# EAGLE schematic ultraino6 (EAGLE 8.3.2)
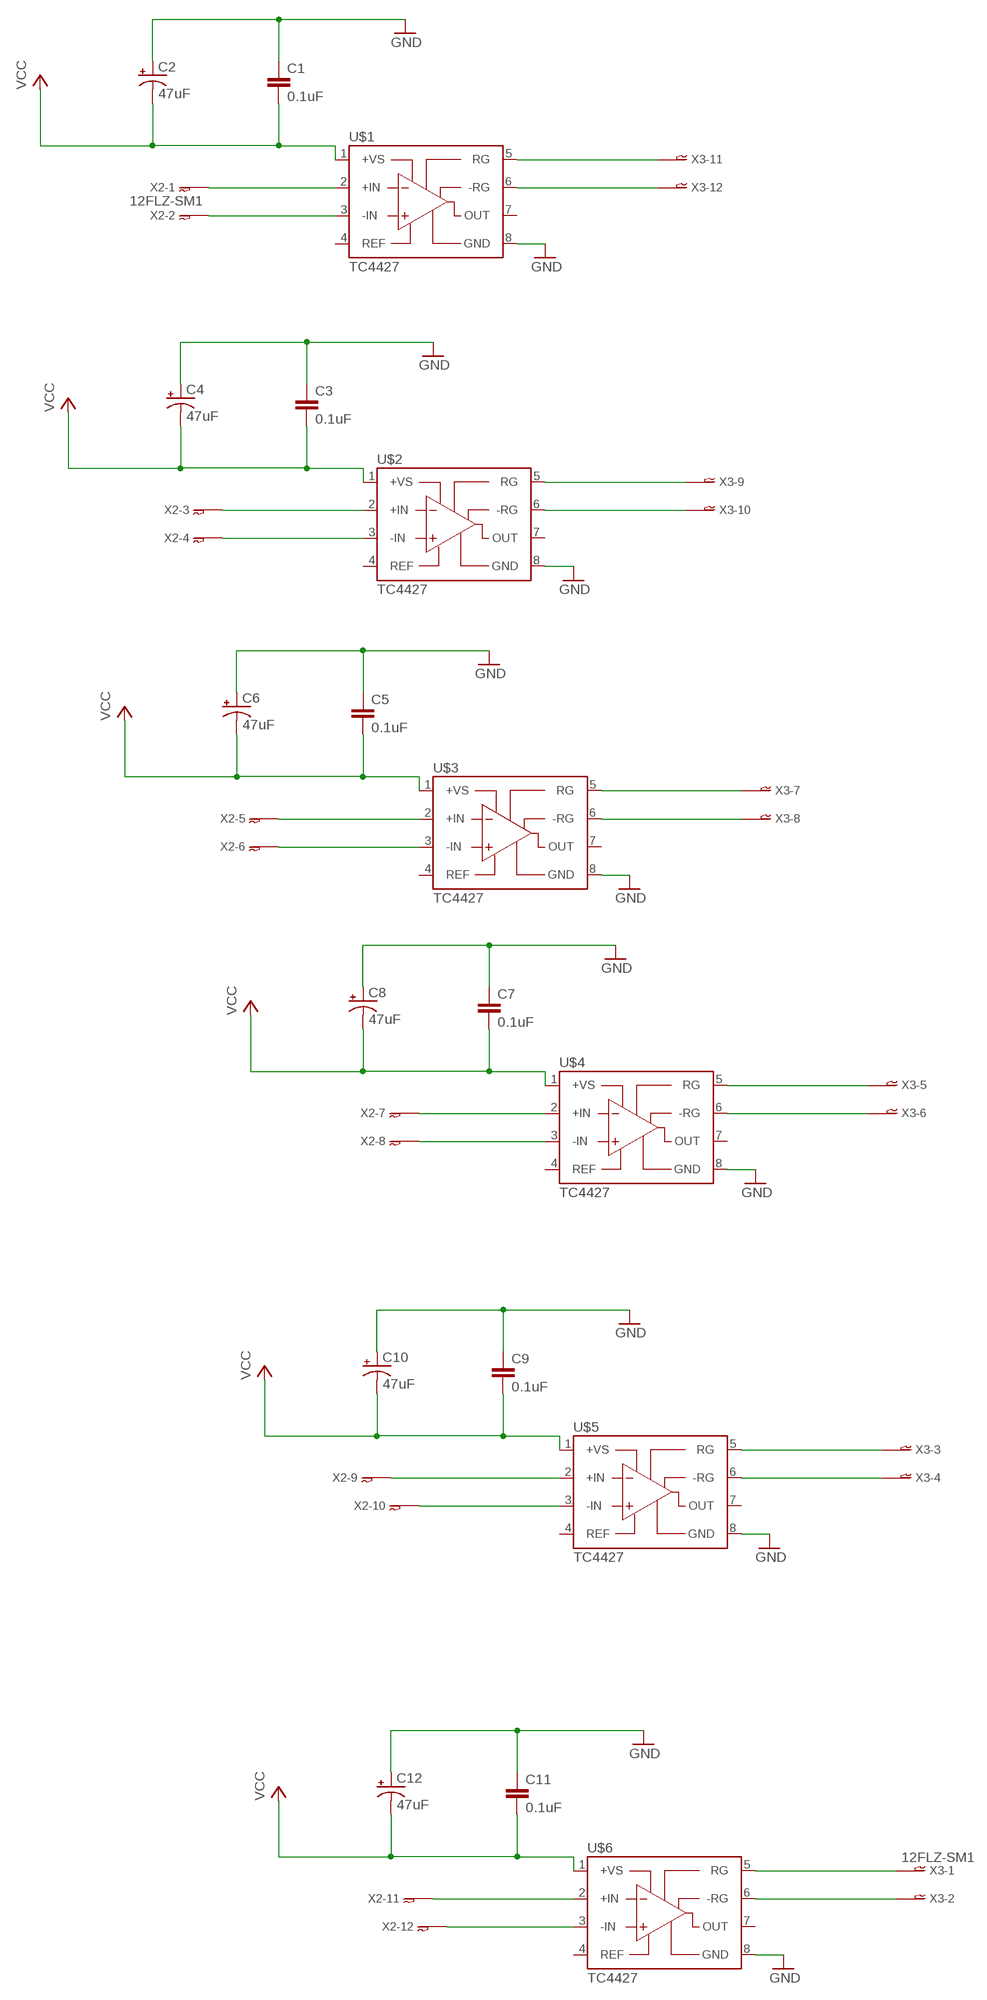
[diagram p0: schematic, sheet 1]

## Parts
C1  0.1uF  0.1UF-0402-16V-10%  [0402]
C2  47uF  47UF-POLAR-EIA3528-10V-10%  [EIA3528]
C3  0.1uF  0.1UF-0402-16V-10%  [0402]
C4  47uF  47UF-POLAR-EIA3528-10V-10%  [EIA3528]
C5  0.1uF  0.1UF-0402-16V-10%  [0402]
C6  47uF  47UF-POLAR-EIA3528-10V-10%  [EIA3528]
C7  0.1uF  0.1UF-0402-16V-10%  [0402]
C8  47uF  47UF-POLAR-EIA3528-10V-10%  [EIA3528]
C9  0.1uF  0.1UF-0402-16V-10%  [0402]
C10  47uF  47UF-POLAR-EIA3528-10V-10%  [EIA3528]
C11  0.1uF  0.1UF-0402-16V-10%  [0402]
C12  47uF  47UF-POLAR-EIA3528-10V-10%  [EIA3528]
U$1  TC4427  [SOIC-8]
U$2  TC4427  [SOIC-8]
U$3  TC4427  [SOIC-8]
U$4  TC4427  [SOIC-8]
U$5  TC4427  [SOIC-8]
U$6  TC4427  [SOIC-8]
X2  12FLZ-SM1  [12FLZ-SM]
X3  12FLZ-SM1  [12FLZ-SM]

## Nets
GND [GND]: C1.1 C2.A(+) C3.1 C4.A(+) C5.1 C6.A(+) C7.1 C8.A(+) C9.1 C10.A(+) C11.1 C12.A(+) U$1.8(GND) U$2.8(GND) U$3.8(GND) U$4.8(GND) U$5.8(GND) U$6.8(GND)
N$1 [GND]: U$1.2(+IN) X2.1
N$2: U$1.3(-IN) X2.2
N$3: U$1.5(RG) X3.11
N$4: U$1.6(-RG) X3.12
N$5 [GND]: U$2.2(+IN) X2.3
N$6: U$2.5(RG) X3.9
N$7: U$2.6(-RG) X3.10
N$8: U$2.3(-IN) X2.4
N$9 [GND]: U$3.2(+IN) X2.5
N$10: U$3.5(RG) X3.7
N$11: U$3.6(-RG) X3.8
N$12: U$3.3(-IN) X2.6
N$13 [GND]: U$4.2(+IN) X2.7
N$14: U$4.5(RG) X3.5
N$15: U$4.6(-RG) X3.6
N$16: U$4.3(-IN) X2.8
N$17 [GND]: U$5.2(+IN) X2.9
N$18: U$5.5(RG) X3.3
N$19: U$5.6(-RG) X3.4
N$20: U$5.3(-IN) X2.10
N$21 [GND]: U$6.2(+IN) X2.11
N$22: U$6.5(RG) X3.1
N$23: U$6.6(-RG) X3.2
N$24: U$6.3(-IN) X2.12
VCC [GND]: C1.2 C2.C(-) C3.2 C4.C(-) C5.2 C6.C(-) C7.2 C8.C(-) C9.2 C10.C(-) C11.2 C12.C(-) U$1.1(+VS) U$2.1(+VS) U$3.1(+VS) U$4.1(+VS) U$5.1(+VS) U$6.1(+VS)
Unconnected: U$1.4(REF) U$1.7(OUT) U$2.4(REF) U$2.7(OUT) U$3.4(REF) U$3.7(OUT) U$4.4(REF) U$4.7(OUT) U$5.4(REF) U$5.7(OUT) U$6.4(REF) U$6.7(OUT)

## Library data of the parts
C1 C3 C5 C7 C9 C11 = capacitor:0.1UF: 0.1�F ceramic capacitors A capacitor is a passive two-terminal electrical component used to store electrical energy temporarily in an electric field.; PROD_ID: CAP-12416
C2 C4 C6 C8 C10 C12 = capacitor:47UF-POLAR: 47�F polarized capacitors A capacitor is a passive two-terminal electrical component used to store electrical energy temporarily in an electric field.; PROD_ID: CAP-08310
U$1-U$6 = example:TC4427
X2 X3 = con-jst:12FLZ-SM1: CONNECTOR; OC_FARNELL: unknown; OC_NEWARK: unknown

## Net classes
1 GND: width 0.635 mm